# Altium schematic sheet 11 - Wireless - CAN.SchDoc
size B; CompanyName: Microchip Technology Inc.; Organization: Microchip Technology; Address1: 2355 West Chandler Blvd.; Address2: Chandler, AZ  85224; Address4: USA; SheetNumber: 12; SheetTotal: 15; SheetTitle: Wireless - CAN; Time: Time
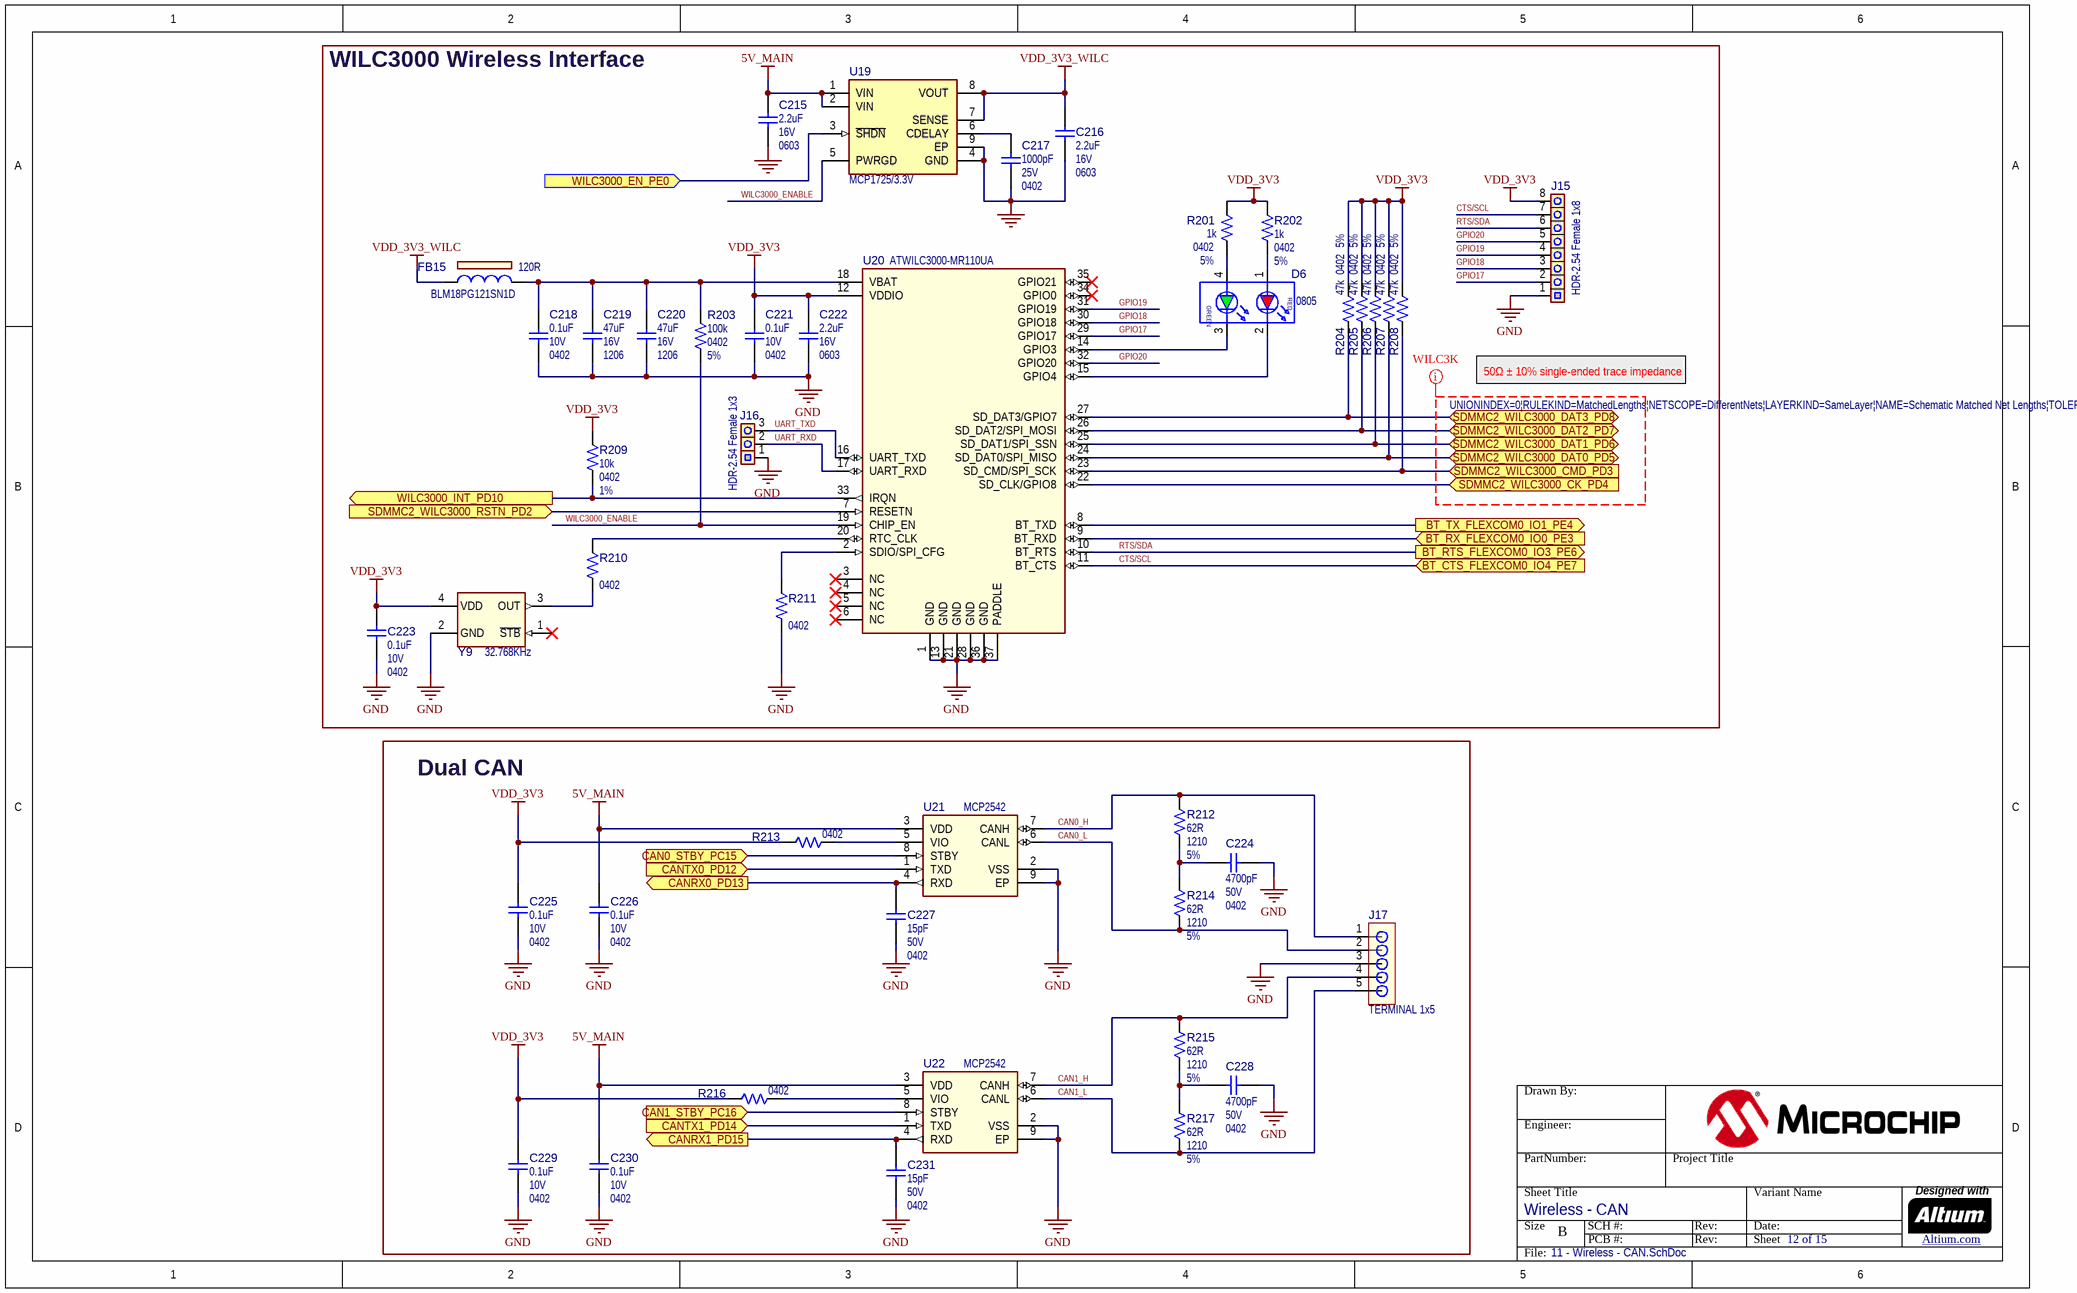
[diagram p0: 11 - Wireless - CAN.SchDoc]

## Parts
?  (no value)  (graphical)
C215  value 2.2uF  Voltage: 16V  Package: 0603  [CAP_C_0603]  (hidden comment: Capacitor NP)
C216  value 2.2uF  Voltage: 16V  Package: 0603  [CAP_C_0603]  (hidden comment: Capacitor NP)
C217  value 1000pF  Voltage: 25V  Package: 0402  [CAP_C_0402]  (hidden comment: Capacitor NP)
C218  value 0.1uF  Voltage: 10V  Package: 0402  [CAP_C_0402]  (hidden comment: Capacitor NP)
C219  value 47uF  Voltage: 16V  Package: 1206  [CAP_C_1206]  (hidden comment: Capacitor NP)
C220  value 47uF  Voltage: 16V  Package: 1206  [CAP_C_1206]  (hidden comment: Capacitor NP)
C221  value 0.1uF  Voltage: 10V  Package: 0402  [CAP_C_0402]  (hidden comment: Capacitor NP)
C222  value 2.2uF  Voltage: 16V  Package: 0603  [CAP_C_0603]  (hidden comment: Capacitor NP)
C223  value 0.1uF  Voltage: 10V  Package: 0402  [CAP_C_0402]  (hidden comment: Capacitor NP)
C224  value 4700pF  Voltage: 50V  Package: 0402  [CAP_C_0402]  (hidden comment: Capacitor NP)
C225  value 0.1uF  Voltage: 10V  Package: 0402  [CAP_C_0402]  (hidden comment: Capacitor NP)
C226  value 0.1uF  Voltage: 10V  Package: 0402  [CAP_C_0402]  (hidden comment: Capacitor NP)
C227  value 15pF  Voltage: 50V  Package: 0402  [CAP_C_0402]  (hidden comment: Capacitor NP)
C228  value 4700pF  Voltage: 50V  Package: 0402  [CAP_C_0402]  (hidden comment: Capacitor NP)
C229  value 0.1uF  Voltage: 10V  Package: 0402  [CAP_C_0402]  (hidden comment: Capacitor NP)
C230  value 0.1uF  Voltage: 10V  Package: 0402  [CAP_C_0402]  (hidden comment: Capacitor NP)
C231  value 15pF  Voltage: 50V  Package: 0402  [CAP_C_0402]  (hidden comment: Capacitor NP)
D6  Package: 0805  [LED_DUAL_SMD_2x1.25mm]  (hidden comment: LED DUAL 4 pin)
FB15  value 120R  Manufacturer Part Number 1: BLM18PG121SN1D  [IND_C_0603]  (hidden comment: Ferrite Bead)
J15  value HDR-2.54 Female 1x8  [HDR_F_2.54_1X8]  (hidden comment: Header 1x8)
J16  value HDR-2.54 Female 1x3  [HDR_F_2.54_1x3]  (hidden comment: Header 1x3)
J17  value TERMINAL 1x5  [CON_TERMINAL_3.81_1x5_TH_RA_PHO_1727049]  (hidden comment: Header 1x5)
R201  value 1k  Package: 0402  Tolerance: 5%  [RES_C_0402]  (hidden comment: Resistor)
R202  value 1k  Package: 0402  Tolerance: 5%  [RES_C_0402]  (hidden comment: Resistor)
R203  value 100k  Package: 0402  Tolerance: 5%  [RES_C_0402]  (hidden comment: Resistor)
R204  value 47k  Package: 0402  Tolerance: 5%  [RES_C_0402]  (hidden comment: Resistor)
R205  value 47k  Package: 0402  Tolerance: 5%  [RES_C_0402]  (hidden comment: Resistor)
R206  value 47k  Package: 0402  Tolerance: 5%  [RES_C_0402]  (hidden comment: Resistor)
R207  value 47k  Package: 0402  Tolerance: 5%  [RES_C_0402]  (hidden comment: Resistor)
R208  value 47k  Package: 0402  Tolerance: 5%  [RES_C_0402]  (hidden comment: Resistor)
R209  value 10k  Package: 0402  Tolerance: 1%  [RES_C_0402]  (hidden comment: Resistor)
R210  Package: 0402  [RES_C_0402]  (hidden comment: Resistor)
R211  Package: 0402  [RES_C_0402]  (hidden comment: Resistor)
R212  value 62R  Package: 1210  Tolerance: 5%  [RES_C_1210]  (hidden comment: Resistor)
R213  Package: 0402  [RES_C_0402]  (hidden comment: Resistor)
R214  value 62R  Package: 1210  Tolerance: 5%  [RES_C_1210]  (hidden comment: Resistor)
R215  value 62R  Package: 1210  Tolerance: 5%  [RES_C_1210]  (hidden comment: Resistor)
R216  Package: 0402  [RES_C_0402]  (hidden comment: Resistor)
R217  value 62R  Package: 1210  Tolerance: 5%  [RES_C_1210]  (hidden comment: Resistor)
U19  value MCP1725/3.3V  [DFN-8_2x3]  (hidden comment: MCP172X FIX DFN-8)
U20  value ATWILC3000-MR110UA  [MODULE ATWILC3000-MR110CA]  (hidden comment: MODULE ATWILC3000-MR110CA)
U21  value MCP2542  [DFN-8_3x3_EP2.4X1.55]  (hidden comment: MCP2542 DFN-8)
U22  value MCP2542  [DFN-8_3x3_EP2.4X1.55]  (hidden comment: MCP2542 DFN-8)
Y9  value 32.768KHz  [DFN-4_2x1.6]  (hidden comment: DSC60xx DFN-4_LGA-4)

## Blocks framed on the sheet
WILC3000 Wireless Interface: C215-C223 D6 FB15 J15 J16 R201-R211 U19 U20 Y9
Dual CAN: C224-C231 J17 R212-R217 U21 U22

## Ports
BT_CTS_FLEXCOM0_IO4_PE7 (in), BT_RTS_FLEXCOM0_IO3_PE6 (out), BT_RX_FLEXCOM0_IO0_PE3 (in), BT_TX_FLEXCOM0_IO1_PE4 (out), CAN0_STBY_PC15 (in), CAN1_STBY_PC16 (in), CANRX0_PD13 (out), CANRX1_PD15 (out), CANTX0_PD12 (in), CANTX1_PD14 (in), SDMMC2_WILC3000_CK_PD4 (in), SDMMC2_WILC3000_CMD_PD3 (in), SDMMC2_WILC3000_DAT0_PD5 (bidir), SDMMC2_WILC3000_DAT1_PD6 (bidir), SDMMC2_WILC3000_DAT2_PD7 (bidir), SDMMC2_WILC3000_DAT3_PD8 (bidir), SDMMC2_WILC3000_RSTN_PD2 (in), WILC3000_EN_PE0 (in), WILC3000_INT_PD10 (out)

## Nets
5V_MAIN: C215.1 C226.1 C230.1 U19.1(VIN) U19.2(VIN) U21.3(VDD) U22.3(VDD)
GND: C215.2 C216.1 C217.1 C218.2 C219.2 C220.2 C221.2 C222.1 C223.2 C224.1 C225.2 C226.2 C227.1 C228.1 C229.2 C230.2 C231.1 J15.1 J16.1 J17.3 R211.2 U19.4(GND) U19.9(EP) U20.1(GND) U20.13(GND) U20.21(GND) U20.28(GND) U20.36(GND) U20.37(PADDLE) U21.2(VSS) U21.9(EP) U22.2(VSS) U22.9(EP) Y9.2(GND)
VDD_3V3: C221.1 C222.2 C223.1 C225.1 C229.1 J15.8 R201.2 R202.2 R204.2 R205.2 R206.2 R207.2 R208.2 R209.2 R213.1 R216.1 U20.12(VDDIO) Y9.4(VDD)
VDD_3V3_WILC: C216.2 FB15.1 U19.7(SENSE) U19.8(VOUT)
BT_RX_FLEXCOM0_IO0_PE3: U20.9(BT_RXD) ; port BT_RX_FLEXCOM0_IO0_PE3
BT_TX_FLEXCOM0_IO1_PE4: U20.8(BT_TXD) ; port BT_TX_FLEXCOM0_IO1_PE4
CAN0_H: J17.1 R212.2 U21.7(CANH)
CAN0_L: J17.2 R214.1 U21.6(CANL)
CAN0_STBY_PC15: U21.8(STBY) ; port CAN0_STBY_PC15
CAN1_H: J17.4 R215.2 U22.7(CANH)
CAN1_L: J17.5 R217.1 U22.6(CANL)
CAN1_STBY_PC16: U22.8(STBY) ; port CAN1_STBY_PC16
CANRX0_PD13: C227.2 U21.4(RXD) ; port CANRX0_PD13
CANRX1_PD15: C231.2 U22.4(RXD) ; port CANRX1_PD15
CANTX0_PD12: U21.1(TXD) ; port CANTX0_PD12
CANTX1_PD14: U22.1(TXD) ; port CANTX1_PD14
CTS/SCL: J15.7 U20.11(BT_CTS) ; port BT_CTS_FLEXCOM0_IO4_PE7
GPIO17: J15.2 U20.29(GPIO17)
GPIO18: J15.3 U20.30(GPIO18)
GPIO19: J15.4 U20.31(GPIO19)
GPIO20: J15.5 U20.32(GPIO20)
RTS/SDA: J15.6 U20.10(BT_RTS) ; port BT_RTS_FLEXCOM0_IO3_PE6
SDMMC2_WILC3000_CK_PD4: U20.22(SD_CLK/GPIO8) ; port SDMMC2_WILC3000_CK_PD4
SDMMC2_WILC3000_CMD_PD3: R208.1 U20.23(SD_CMD/SPI_SCK) ; port SDMMC2_WILC3000_CMD_PD3
SDMMC2_WILC3000_DAT0_PD5: R207.1 U20.24(SD_DAT0/SPI_MISO) ; port SDMMC2_WILC3000_DAT0_PD5
SDMMC2_WILC3000_DAT1_PD6: R206.1 U20.25(SD_DAT1/SPI_SSN) ; port SDMMC2_WILC3000_DAT1_PD6
SDMMC2_WILC3000_DAT2_PD7: R205.1 U20.26(SD_DAT2/SPI_MOSI) ; port SDMMC2_WILC3000_DAT2_PD7
SDMMC2_WILC3000_DAT3_PD8: R204.1 U20.27(SD_DAT3/GPIO7) ; port SDMMC2_WILC3000_DAT3_PD8
SDMMC2_WILC3000_RSTN_PD2: U20.7(RESETN) ; port SDMMC2_WILC3000_RSTN_PD2
UART_RXD: J16.2 U20.17(UART_RXD)
UART_TXD: J16.3 U20.16(UART_TXD)
WILC3000_EN_PE0: U19.3(~{SHDN}) ; port WILC3000_EN_PE0
WILC3000_ENABLE: R203.1 U19.5(PWRGD) U20.19(CHIP_EN)
WILC3000_INT_PD10: R209.1 U20.33(IRQN) ; port WILC3000_INT_PD10
NetC217_2: C217.2 U19.6(CDELAY)
NetC218_1: C218.1 C219.1 C220.1 FB15.2 R203.2 U20.18(VBAT)
NetC224_2: C224.2 R212.1 R214.2
NetC228_2: C228.2 R215.1 R217.2
NetD6_1: D6.1(A1) R202.1
NetD6_2: D6.2(K1) U20.15(GPIO4)
NetD6_3: D6.3(K2) U20.14(GPIO3)
NetD6_4: D6.4(A2) R201.1
NetR210_1: R210.1 U20.20(RTC_CLK)
NetR210_2: R210.2 Y9.3(OUT)
NetR211_1: R211.1 U20.2(SDIO/SPI_CFG)
NetR213_2: R213.2 U21.5(VIO)
NetR216_2: R216.2 U22.5(VIO)

Not connected (* = marked no-connect by the designer): U20 3(NC)* 4(NC)* 5(NC)* 6(NC)* 34(GPIO0)* 35(GPIO21)*; Y9 1(~{STB})*

## Layout directives
net class WILC3K; rule Matched Net Lengths [Tolerance = 0.25mm]: (no net found under the mark)

## Notes on the sheet
- 50Ω ± 10% single-ended trace impedance
- Drawn By:
- Engineer:
- PartNumber:
- Project Title
- Sheet Title
- Size
- B
- SCH #:
- PCB #:
- Rev:
- Variant Name
- Date:
- Sheet
- Designed with
- Altium.com <http://go.altium.com/MicrochipLandingPage_Evaluation.html>
- File:
- (in symbol DIODE1110) RED; GREEN

## Library data of the parts
? = Title Block B
C215 C216 C222 = CAP0597: Capacitor; Manufacturer 1: TDK; Manufacturer Part Number 1: C1608X5R1C225K; Description_: CAP CER 2.2uF 16V 10% X5R SMD 0603; Dev Tools Status: Production; Tolerance: 10%; Temperature Coeffcient: X5R; Type: Ceramic; Populated: Yes; MCHP-ID: CAP0597; Revision: 2; Symbol: Capacitor NP; Status: MCL Design; ComponentLink1URL: https://chn-vm-apps.microchip.com/mchprepo/parts/Datasheets/general_B11.pdf; ComponentLink1Description: SVN Datasheet; ComponentLink2URL: C:\ALTIUM_WORK\00001_MCHP-CDB\Datasheets\general_B11.pdf; ComponentLink2Description: Local Datasheet; ComponentLink3URL: C:\ALTIUM_WORK\00001_MCHP-CDB\Library\LibraryRefs\Capacitor NP.SchLib; ComponentLink3Description: Open Symbol; ComponentLink4URL: C:\ALTIUM_WORK\00001_MCHP-CDB\Library\Footprints\CAP_C_0603.PcbLib; ComponentLink4Description: Open Footprint; ComponentLink5Description: Open Footprint 2; ComponentLink6Description: Open Footprint 3; ComponentLink7Description: Open Footprint 4; Operating Temperature: -55C to +85C; Category: Capacitor; Supplier 1: Digi-Key; Supplier Part Number 1: 445-5157-1-ND; Quantity Override: 1
C217 = CAP2439: Manufacturer 1: Samsung Electro-Mechanics; Manufacturer Part Number 1: CL05B102KA5NNWC; Description_: Ceramic capacitor, SMD 0402, X7R, 25V, +/-10%, 1000pF; Dev Tools Status: Design; Tolerance: 10%; Temperature Coeffcient: X7R; Type: Ceramic; Populated: YES; Owner: Dragos Danaila; MCHP-ID: CAP2439; Revision: 1; Symbol: Capacitor NP; Status: MCL Design; ComponentLink1URL: https://chn-vm-apps.microchip.com/mchprepo/parts/Datasheets/MLCC.pdf; ComponentLink1Description: SVN Datasheet; ComponentLink2URL: C:\ALTIUM_WORK\00001_MCHP-CDB\Datasheets\MLCC.pdf; ComponentLink2Description: Local Datasheet; ComponentLink3URL: C:\ALTIUM_WORK\00001_MCHP-CDB\Library\LibraryRefs\Capacitor NP.SchLib; ComponentLink3Description: Open Symbol; ComponentLink4URL: C:\ALTIUM_WORK\00001_MCHP-CDB\Library\Footprints\CAP_C_0402.PcbLib; ComponentLink4Description: Open Footprint; ComponentLink5Description: Open Footprint 2; ComponentLink6Description: Open Footprint 3; ComponentLink7Description: Open Footprint 4; Operating Temperature: -55C to +125C; Category: Capacitor; Supplier 1: Digikey; Supplier Part Number 1: 1276-1490-1-ND; Quantity Override: 1
C218 C221 C223 C225 C226 C229 C230 = CAP1238: Capacitor; Manufacturer 1: KEMET; Manufacturer Part Number 1: C0402C104K8RACTU; Description_: CAP CER 0.1uF 10V 10% X7R SMD 0402; Dev Tools Status: Production; Tolerance: 10%; Temperature Coeffcient: X7R; Type: Ceramic; Owner: Tad Ahlvers; Populated: YES; MCHP-ID: CAP1238; Revision: 1; Symbol: Capacitor NP; Status: MCL Design; ComponentLink1URL: https://chn-vm-apps.microchip.com/mchprepo/parts/Datasheets/KEM_C1002_X7R_SMD.pdf; ComponentLink1Description: SVN Datasheet; ComponentLink2URL: C:\ALTIUM_WORK\00001_MCHP-CDB\Datasheets\KEM_C1002_X7R_SMD.pdf; ComponentLink2Description: Local Datasheet; ComponentLink3URL: C:\ALTIUM_WORK\00001_MCHP-CDB\Library\LibraryRefs\Capacitor NP.SchLib; ComponentLink3Description: Open Symbol; ComponentLink4URL: C:\ALTIUM_WORK\00001_MCHP-CDB\Library\Footprints\CAP_C_0402.PcbLib; ComponentLink4Description: Open Footprint; ComponentLink5Description: Open Footprint 2; ComponentLink6Description: Open Footprint 3; ComponentLink7Description: Open Footprint 4; Operating Temperature: -55C to +125C; Category: Capacitor; Supplier 1: Digi-Key; Supplier Part Number 1: 399-3520-2-ND; Quantity Override: 1; Manufacturer 2: Samsung; Manufacturer Part Number 2: CL05B104KP5NNNC; Manufacturer 3: Murata Electronics; Manufacturer Part Number 3: GRM155R71A104KA01D; Supplier 2: Digi-Key; Supplier Part Number 2: 1276-1002-2-ND; Supplier 3: Mouser; Supplier Part Number 3: 81-GRM155R71A104KA1D
C219 = CAP1331: Capacitor; Manufacturer 1: TDK Corporation; Manufacturer Part Number 1: C3216X5R1C476M160AB; Description_: CAP CER 47uF 16V 20% X5R SMD 1206; Dev Tools Status: Production; Tolerance: 20%; Temperature Coeffcient: X5R; Type: Ceramic; Owner: Bogdan Popescu; Populated: YES; MCHP-ID: CAP1331; Revision: 1; Symbol: Capacitor NP; Status: MCL Design; ComponentLink1URL: https://chn-vm-apps.microchip.com/mchprepo/parts/Datasheets/TDKMLCCCapRange.pdf; ComponentLink1Description: SVN Datasheet; ComponentLink2URL: C:\ALTIUM_WORK\00001_MCHP-CDB\Datasheets\TDKMLCCCapRange.pdf; ComponentLink2Description: Local Datasheet; ComponentLink3URL: C:\ALTIUM_WORK\00001_MCHP-CDB\Library\LibraryRefs\Capacitor NP.SchLib; ComponentLink3Description: Open Symbol; ComponentLink4URL: C:\ALTIUM_WORK\00001_MCHP-CDB\Library\Footprints\CAP_C_1206.PcbLib; ComponentLink4Description: Open Footprint; ComponentLink5Description: Open Footprint 2; ComponentLink6Description: Open Footprint 3; ComponentLink7Description: Open Footprint 4; Operating Temperature: -55C to +85C; Category: Capacitor; Supplier 1: Digi-Key; Supplier Part Number 1: 445-6003-1-ND; Quantity Override: 1
C220 = CAP1331: Capacitor; Manufacturer 1: TDK Corporation; Manufacturer Part Number 1: C3216X5R1C476M160AB; Description_: CAP CER 47uF 16V 20% X5R SMD 1206; Dev Tools Status: Production; Tolerance: 20%; Temperature Coeffcient: X5R; Type: Ceramic; Owner: Bogdan Popescu; Populated: DNP; MCHP-ID: CAP1331; Revision: 1; Symbol: Capacitor NP; Status: MCL Design; ComponentLink1URL: https://chn-vm-apps.microchip.com/mchprepo/parts/Datasheets/TDKMLCCCapRange.pdf; ComponentLink1Description: SVN Datasheet; ComponentLink2URL: C:\ALTIUM_WORK\00001_MCHP-CDB\Datasheets\TDKMLCCCapRange.pdf; ComponentLink2Description: Local Datasheet; ComponentLink3URL: C:\ALTIUM_WORK\00001_MCHP-CDB\Library\LibraryRefs\Capacitor NP.SchLib; ComponentLink3Description: Open Symbol; ComponentLink4URL: C:\ALTIUM_WORK\00001_MCHP-CDB\Library\Footprints\CAP_C_1206.PcbLib; ComponentLink4Description: Open Footprint; ComponentLink5Description: Open Footprint 2; ComponentLink6Description: Open Footprint 3; ComponentLink7Description: Open Footprint 4; Operating Temperature: -55C to +85C; Category: Capacitor; Supplier 1: Digi-Key; Supplier Part Number 1: 445-6003-1-ND; Quantity Override: 1
C224 C228 = CAP1391: Capacitor; Manufacturer 1: Murata Electronics North America; Manufacturer Part Number 1: GRM155R71H472KA01D; Description_: CAP CER 4700pF 50V 10% X7R SMD 0402 (Don't Use, Duplicate, use CAP1391); Dev Tools Status: Design; Tolerance: 10%; Temperature Coeffcient: X7R; Type: Ceramic; Owner: Gabor Bihari; Populated: YES; MCHP-ID: CAP1391; Revision: A; Symbol: Capacitor NP; Status: MCL Design; ComponentLink1URL: https://chn-vm-apps.microchip.com/mchprepo/parts/Datasheets/http://www.murata.com/~/media/webrenewal/support/library/catalog/products/capacitor/mlcc/c02e.ashx; ComponentLink1Description: SVN Datasheet; ComponentLink2URL: C:\ALTIUM_WORK\00001_MCHP-CDB\Datasheets\http://www.murata.com/~/media/webrenewal/support/library/catalog/products/capacitor/mlcc/c02e.ashx; ComponentLink2Description: Local Datasheet; ComponentLink3URL: C:\ALTIUM_WORK\00001_MCHP-CDB\Library\LibraryRefs\Capacitor NP.SchLib; ComponentLink3Description: Open Symbol; ComponentLink4URL: C:\ALTIUM_WORK\00001_MCHP-CDB\Library\Footprints\CAP_C_0402.PcbLib; ComponentLink4Description: Open Footprint; ComponentLink5Description: Open Footprint 2; ComponentLink6Description: Open Footprint 3; ComponentLink7Description: Open Footprint 4; Operating Temperature: -55C to 125C; Category: Capacitor; Supplier 1: Digi-Key; Supplier Part Number 1: 490-1308-1-ND; Quantity Override: 1
C227 C231 = CAP2440: Manufacturer 1: Samsung Electro-Mechanics; Manufacturer Part Number 1: CL05C150JB5NNNC; Description_: Ceramic capacitor, SMD 0402, C0G, 50V, +/-10%, 15pF; Dev Tools Status: Design; Tolerance: 5%; Temperature Coeffcient: C0G; Type: Ceramic; Populated: YES; Owner: Dragos Danaila; MCHP-ID: CAP2440; Revision: 1; Symbol: Capacitor NP; Status: MCL Design; ComponentLink1URL: https://chn-vm-apps.microchip.com/mchprepo/parts/Datasheets/CL_Series_MLCC_ds.pdf; ComponentLink1Description: SVN Datasheet; ComponentLink2URL: C:\ALTIUM_WORK\00001_MCHP-CDB\Datasheets\CL_Series_MLCC_ds.pdf; ComponentLink2Description: Local Datasheet; ComponentLink3URL: C:\ALTIUM_WORK\00001_MCHP-CDB\Library\LibraryRefs\Capacitor NP.SchLib; ComponentLink3Description: Open Symbol; ComponentLink4URL: C:\ALTIUM_WORK\00001_MCHP-CDB\Library\Footprints\CAP_C_0402.PcbLib; ComponentLink4Description: Open Footprint; ComponentLink5Description: Open Footprint 2; ComponentLink6Description: Open Footprint 3; ComponentLink7Description: Open Footprint 4; Operating Temperature: -55C to +125C; Category: Capacitor; Supplier 1: Digikey; Supplier Part Number 1: 1276-1179-1-ND; Quantity Override: 1
D6 = DIODE1110: LED; Manufacturer 1: Kingbright Corp; Manufacturer Part Number 1: APHBM2012SURKCGKC; Value: RED, GREEN; Description_: DIO LED BI RED, GREEN 1.95V, 2.1V 30mA 0805; Dev Tools Status: Production; Type: LED Bicolor; Forward Current: 30mA; Power: 75mW; Reverse Current: 10uA; Owner: Bogdan P (M91398); Populated: Yes; MCHP-ID: DIODE1110; Revision: 0; Symbol: LED DUAL 4 PIN; Status: MCL Design; ComponentLink1URL: https://chn-vm-apps.microchip.com/mchprepo/parts/Datasheets/APHBM2012SURKCGKC.pdf; ComponentLink1Description: SVN Datasheet; ComponentLink2URL: C:\ALTIUM_WORK\00001_MCHP-CDB\Datasheets\APHBM2012SURKCGKC.pdf; ComponentLink2Description: Local Datasheet; ComponentLink3URL: C:\ALTIUM_WORK\00001_MCHP-CDB\Library\LibraryRefs\LED DUAL 4 PIN.SchLib; ComponentLink3Description: Open Symbol; ComponentLink4URL: C:\ALTIUM_WORK\00001_MCHP-CDB\Library\Footprints\LED_DUAL_SMD_2x1.25mm.PcbLib; ComponentLink4Description: Open Footprint; ComponentLink5Description: Open Footprint 2; ComponentLink6Description: Open Footprint 3; ComponentLink7Description: Open Footprint 4; Operating Temperature: -40C to +85C; Category: Diode; Supplier 1: Digi-Key; Supplier Part Number 1: 754-1093-1-ND; Quantity Override: 1
FB15 = IND1009: Manufacturer 1: Murata; Description_: FERRITE 120R@100MHz 2A SMD 0603; Dev Tools Status: Production; Owner: Petnarong Chaijaroong; DCR: 0.05R; Saturation Current: 12A; Populated: Yes; MCHP-ID: IND1009; Revision: 0; Symbol: Ferrite Bead; Status: MCL Design; ComponentLink1URL: https://chn-vm-apps.microchip.com/mchprepo/parts/Datasheets/L0110S0100BLM18P.pdf; ComponentLink1Description: SVN Datasheet; ComponentLink2URL: C:\ALTIUM_WORK\00001_MCHP-CDB\Datasheets\L0110S0100BLM18P.pdf; ComponentLink2Description: Local Datasheet; ComponentLink3URL: C:\ALTIUM_WORK\00001_MCHP-CDB\Library\LibraryRefs\Ferrite Bead.SchLib; ComponentLink3Description: Open Symbol; ComponentLink4URL: C:\ALTIUM_WORK\00001_MCHP-CDB\Library\Footprints\IND_C_0603.PcbLib; ComponentLink4Description: Open Footprint; ComponentLink5Description: Open Footprint 2; ComponentLink6Description: Open Footprint 3; ComponentLink7Description: Open Footprint 4; Operating Temperature: -55C to +125C; Package: 0603; Type: Ferrite Bead; Category: Inductor; Supplier 1: Digi-Key; Supplier Part Number 1: 490-1037-1-ND; Quantity Override: 1
J15 = CON1363: CON HDR-2.54 Female 1x8 Gold TH; Manufacturer 1: Sullins Connector Solutions; Manufacturer Part Number 1: PPPC081LFBN-RC; Dev Tools Status: Production; Owner: Jamus Griego; Populated: DNP; MCHP-ID: CON1363; Revision: 1; Symbol: Header 1x8; Description_: CON HDR-2.54 Female 1x8 Gold TH; Status: MCL Design; ComponentLink1URL: https://chn-vm-apps.microchip.com/mchprepo/parts/Datasheets/78_P(N)PxCxxxLFBN-RC,_10492-G.pdf; ComponentLink1Description: SVN Datasheet; ComponentLink2URL: C:\ALTIUM_WORK\00001_MCHP-CDB\Datasheets\78_P(N)PxCxxxLFBN-RC,_10492-G.pdf; ComponentLink2Description: Local Datasheet; ComponentLink3URL: C:\ALTIUM_WORK\00001_MCHP-CDB\Library\LibraryRefs\Header 1x8.SchLib; ComponentLink3Description: Open Symbol; ComponentLink4URL: C:\ALTIUM_WORK\00001_MCHP-CDB\Library\Footprints\HDR_F_2.54_1X8.PcbLib; ComponentLink4Description: Open Footprint; ComponentLink5Description: Open Footprint 2; ComponentLink6Description: Open Footprint 3; ComponentLink7Description: Open Footprint 4; Type: Header 2.54mm; Category: Connector; Manufacturer 2: Nextron; Manufacturer Part Number 2: R-212-0810-0071-000; Supplier 1: Digi-Key; Supplier Part Number 1: S7041-ND; Supplier 2: Nextron; Supplier Part Number 2: R-212-0810-0071-000; Quantity Override: 1
J16 = CON1425: Manufacturer 1: TE Connectivity AMP Connectors; Manufacturer Part Number 1: 5-534237-1; Description_: CON HDR-2.54 Female 1x3 Gold 8.64MH TH VERT; Dev Tools Status: Production; Owner: Md Khan; Populated: DNP; MCHP-ID: CON1425; Revision: 1; Symbol: Header 1x3; Status: MCL Design; ComponentLink1Description: SVN Datasheet; ComponentLink2Description: Local Datasheet; ComponentLink3URL: C:\ALTIUM_WORK\00001_MCHP-CDB\Library\LibraryRefs\Header 1x3.SchLib; ComponentLink3Description: Open Symbol; ComponentLink4URL: C:\ALTIUM_WORK\00001_MCHP-CDB\Library\Footprints\HDR_F_2.54_1x3.PcbLib; ComponentLink4Description: Open Footprint; ComponentLink5Description: Open Footprint 2; ComponentLink6Description: Open Footprint 3; ComponentLink7Description: Open Footprint 4; Type: Header 2.54mm; Category: Connector; Supplier 1: Digi-Key; Supplier Part Number 1: A32904-ND; Quantity Override: 1
J17 = CON1693: Manufacturer 1: Phoenix Contact; Manufacturer Part Number 1: 1727049; Description_: CON TERMINAL 3.81mm 1x5 Female 16-30AWG 13.5A TH R/A; Dev Tools Status: Design; Owner: Ciprian Abramov; Voltage: 300; Current: 13.5A; Populated: YES; MCHP-ID: CON1693; Revision: A; Symbol: CON TERM BLK 1x5 TH Mount; Status: MCL Design; ComponentLink1URL: https://chn-vm-apps.microchip.com/mchprepo/parts/Datasheets/1727049.pdf; ComponentLink1Description: SVN Datasheet; ComponentLink2URL: C:\ALTIUM_WORK\00001_MCHP-CDB\Datasheets\1727049.pdf; ComponentLink2Description: Local Datasheet; ComponentLink3URL: C:\ALTIUM_WORK\00001_MCHP-CDB\Library\LibraryRefs\CON TERM BLK 1x5 TH Mount.SchLib; ComponentLink3Description: Open Symbol; ComponentLink4URL: C:\ALTIUM_WORK\00001_MCHP-CDB\Library\Footprints\CON_TERMINAL_3.81_1x5_TH_RA_PHO_1727049.PcbLib; ComponentLink4Description: Open Footprint; ComponentLink5Description: Open Footprint 2; ComponentLink6Description: Open Footprint 3; ComponentLink7Description: Open Footprint 4; Type: Terminal Block; Category: Connector; Supplier 1: Digi-Key; Supplier Part Number 1: 277-1950-ND; Quantity Override: 1
R201 R202 = RSMT0316: Manufacturer 1: Panasonic; Manufacturer Part Number 1: ERJ-2GEJ102X; Description_: RES TKF 1k 5% 1/16W SMD 0402; Dev Tools Status: Production; Voltage: 50V; Temperature Coeffcient: 200ppm/C; Power: 1/16W; Owner: Tad Ahlvers; Populated: YES; MCHP-ID: RSMT0316; Revision: 1; Symbol: Resistor; Status: MCL Design; ComponentLink1URL: https://chn-vm-apps.microchip.com/mchprepo/parts/Datasheets/AOA0000CE1.pdf; ComponentLink1Description: SVN Datasheet; ComponentLink2URL: C:\ALTIUM_WORK\00001_MCHP-CDB\Datasheets\AOA0000CE1.pdf; ComponentLink2Description: Local Datasheet; ComponentLink3URL: C:\ALTIUM_WORK\00001_MCHP-CDB\Library\LibraryRefs\Resistor.SchLib; ComponentLink3Description: Open Symbol; ComponentLink4URL: C:\ALTIUM_WORK\00001_MCHP-CDB\Library\Footprints\RES_C_0402.PcbLib; ComponentLink4Description: Open Footprint; ComponentLink5Description: Open Footprint 2; ComponentLink6Description: Open Footprint 3; ComponentLink7Description: Open Footprint 4; Operating Temperature: -55C to +155C; Category: Resistor; Type: RES SMD; Composition: TKF; Supplier 1: Digi-Key; Supplier Part Number 1: P1.0KJCT-ND; Quantity Override: 1
R203 = RSMT0737: Manufacturer 1: Panasonic; Manufacturer Part Number 1: ERJ-2GEJ104X; Description_: RES TKF 100k 5% 1/10W SMD 0402; Dev Tools Status: Production; Temperature Coeffcient: 200ppm/C; Power: 1/10W; Populated: Yes; Voltage: 50V; MCHP-ID: RSMT0737; Revision: 1; Symbol: Resistor; Status: MCL Design; ComponentLink1URL: https://chn-vm-apps.microchip.com/mchprepo/parts/Datasheets/AOA0000CE1.pdf; ComponentLink1Description: SVN Datasheet; ComponentLink2URL: C:\ALTIUM_WORK\00001_MCHP-CDB\Datasheets\AOA0000CE1.pdf; ComponentLink2Description: Local Datasheet; ComponentLink3URL: C:\ALTIUM_WORK\00001_MCHP-CDB\Library\LibraryRefs\Resistor.SchLib; ComponentLink3Description: Open Symbol; ComponentLink4URL: C:\ALTIUM_WORK\00001_MCHP-CDB\Library\Footprints\RES_C_0402.PcbLib; ComponentLink4Description: Open Footprint; ComponentLink5Description: Open Footprint 2; ComponentLink6Description: Open Footprint 3; ComponentLink7Description: Open Footprint 4; Category: Resistor; Type: RES SMD; Composition: TKF; Supplier 1: Digi-Key; Supplier Part Number 1: P100KJCT-ND; Quantity Override: 1; Operating Temperature: -55C to +155C; Manufacturer 2: Stackpole Electronics Inc; Manufacturer Part Number 2: RMCF0402JT100K; Supplier 2: Digi-Key; Supplier Part Number 2: RMCF0402JT100KCT-ND
R204-R208 = RES1038: Manufacturer 1: Panasonic; Manufacturer Part Number 1: ERJ-2GEJ473X; Description_: RES TKF 47k 5% 1/10W SMD 0402; Dev Tools Status: Production; Temperature Coeffcient: 200ppm/C; Power: 1/10W; Owner: Tad Ahlvers; Populated: YES; Voltage: 50V; MCHP-ID: RES1038; Revision: 1; Symbol: Resistor; Status: MCL Design; ComponentLink1URL: https://chn-vm-apps.microchip.com/mchprepo/parts/Datasheets/AOA0000CE1.pdf; ComponentLink1Description: SVN Datasheet; ComponentLink2URL: C:\ALTIUM_WORK\00001_MCHP-CDB\Datasheets\AOA0000CE1.pdf; ComponentLink2Description: Local Datasheet; ComponentLink3URL: C:\ALTIUM_WORK\00001_MCHP-CDB\Library\LibraryRefs\Resistor.SchLib; ComponentLink3Description: Open Symbol; ComponentLink4URL: C:\ALTIUM_WORK\00001_MCHP-CDB\Library\Footprints\RES_C_0402.PcbLib; ComponentLink4Description: Open Footprint; ComponentLink5Description: Open Footprint 2; ComponentLink6Description: Open Footprint 3; ComponentLink7Description: Open Footprint 4; Category: Resistor; Type: RES SMD; Composition: TKF; Supplier 1: Digi-Key; Supplier Part Number 1: P47KJTR-ND; Quantity Override: 1; Operating Temperature: -55C to +155C
R209 = RSMT1019: Manufacturer 1: Panasonic; Manufacturer Part Number 1: ERJ-2RKF1002X; Description_: RES TKF 10k 1% 1/10W SMD 0402; Dev Tools Status: Production; Voltage: 50V; Temperature Coeffcient: 100ppm/C; Power: 1/10W; Populated: Yes; Owner: Brent Lanphear; MCHP-ID: RSMT1019; Revision: 2; Symbol: Resistor; Status: MCL Design; ComponentLink1URL: https://chn-vm-apps.microchip.com/mchprepo/parts/Datasheets/AOA0000CE2.pdf; ComponentLink1Description: SVN Datasheet; ComponentLink2URL: C:\ALTIUM_WORK\00001_MCHP-CDB\Datasheets\AOA0000CE2.pdf; ComponentLink2Description: Local Datasheet; ComponentLink3URL: C:\ALTIUM_WORK\00001_MCHP-CDB\Library\LibraryRefs\Resistor.SchLib; ComponentLink3Description: Open Symbol; ComponentLink4URL: C:\ALTIUM_WORK\00001_MCHP-CDB\Library\Footprints\RES_C_0402.PcbLib; ComponentLink4Description: Open Footprint; ComponentLink5Description: Open Footprint 2; ComponentLink6Description: Open Footprint 3; ComponentLink7Description: Open Footprint 4; Operating Temperature: -55C to +155C; Category: Resistor; Type: RES SMD; Composition: TKF; Supplier 1: Digi-Key; Supplier Part Number 1: P10.0KLCT-ND; Quantity Override: 1
R210 R211 R213 R216 = RES2693: Manufacturer 1: Bourns Inc.; Manufacturer Part Number 1: CR0402-J/-000GLF; Description_: RES TKF 0R 1/16W SMD 0402; Dev Tools Status: Design; Power: 1/16W; Owner: Dragos Danaila; Populated: YES; Voltage: 50V; Temperature Coeffcient: 100ppm/C; Current: 1A; MCHP-ID: RES2693; Revision: 1; Symbol: Resistor; Status: MCL Design; ComponentLink1URL: https://chn-vm-apps.microchip.com/mchprepo/parts/Datasheets/crxxxxx.pdf; ComponentLink1Description: SVN Datasheet; ComponentLink2URL: C:\ALTIUM_WORK\00001_MCHP-CDB\Datasheets\crxxxxx.pdf; ComponentLink2Description: Local Datasheet; ComponentLink3URL: C:\ALTIUM_WORK\00001_MCHP-CDB\Library\LibraryRefs\Resistor.SchLib; ComponentLink3Description: Open Symbol; ComponentLink4URL: C:\ALTIUM_WORK\00001_MCHP-CDB\Library\Footprints\RES_C_0402.PcbLib; ComponentLink4Description: Open Footprint; ComponentLink5Description: Open Footprint 2; ComponentLink6Description: Open Footprint 3; ComponentLink7Description: Open Footprint 4; Operating Temperature: -55C to +155C; Category: Resistor; Type: RES SMD; Composition: TKF; Supplier 1: Digikey; Supplier Part Number 1: CR0402-J/-000GLFTR-ND; Quantity Override: 1
R212 R214 R215 R217 = RES2695: Manufacturer 1: Stackpole Electronics Inc; Manufacturer Part Number 1: RPC1210JT62R0CT-ND; Description_: RES TKF 62R 5% 1/2W SMD 1210; Dev Tools Status: Design; Voltage: 200V; Temperature Coeffcient: 100ppm/C; Power: 1/2W; Owner: Dragos Danaila; Populated: YES; MCHP-ID: RES2695; Revision: 1; Symbol: Resistor; Status: MCL Design; ComponentLink1URL: https://chn-vm-apps.microchip.com/mchprepo/parts/Datasheets/sei-rpc.pdf; ComponentLink1Description: SVN Datasheet; ComponentLink2URL: C:\ALTIUM_WORK\00001_MCHP-CDB\Datasheets\sei-rpc.pdf; ComponentLink2Description: Local Datasheet; ComponentLink3URL: C:\ALTIUM_WORK\00001_MCHP-CDB\Library\LibraryRefs\Resistor.SchLib; ComponentLink3Description: Open Symbol; ComponentLink4URL: C:\ALTIUM_WORK\00001_MCHP-CDB\Library\Footprints\RES_C_1210.PcbLib; ComponentLink4Description: Open Footprint; ComponentLink5Description: Open Footprint 2; ComponentLink6Description: Open Footprint 3; ComponentLink7Description: Open Footprint 4; Operating Temperature: -55C to +155C; Category: Resistor; Type: RES SMD; Composition: TKF; Supplier 1: Digikey; Supplier Part Number 1: RPC1210JT62R0CT-ND; Quantity Override: 1
U19 = MIC2599: LDO; Manufacturer 1: Microchip; Manufacturer Part Number 1: MCP1725T-3302E/MC; Description_: MCHP ANALOG LDO 3.3V MCP1725T-3302E/MC DFN-8; MAPS Description: 500MA, LOW VOLTAGE LDO; Dev Tools Status: Production; MPC: GEAH1YB3XA33; LeadContent: Pb-FREE; PackingMedia: T/R; Stage: REL; LeadCount: 8; PackageWidth: 2x3x0.9mm; ForceMinOrderQtyMult: True; MinOrderQty: 1; TempRange: -40C to +125C; tblDeviceFamilyID: 1781; Populated: Yes; MCHP-ID: MIC2599; Symbol: MCP172X FIX DFN-8; Type: LDO; Status: MCL Design; Revision: 0; Category: MCHP-Analog; ComponentLink1URL: http://www.microchip.com/wwwproducts/MCP1725; ComponentLink1Description: SVN Datasheet; ComponentLink2Description: Local Datasheet; ComponentLink3URL: C:\ALTIUM_WORK\00001_MCHP-CDB\Library\LibraryRefs\MCP172X FIX DFN-8.SchLib; ComponentLink3Description: Open Symbol; ComponentLink4URL: C:\ALTIUM_WORK\00001_MCHP-CDB\Library\Footprints\DFN-8_2x3.PcbLib; ComponentLink4Description: Open Footprint; ComponentLink5Description: Open Footprint 2; ComponentLink6Description: Open Footprint 3; ComponentLink7Description: Open Footprint 4; Manufacturer 2: Microchip; Manufacturer Part Number 2: MCP1725-3302E/MC; Supplier 1: Microchip; Supplier Part Number 1: MCP1725T-3302E/MC; Supplier 2: Microchip; Supplier Part Number 2: MCP1725-3302E/MC; IntroductionDate: 2006-12-22; PackageType: DFN; Quantity Override: 1
U20 = MIC8126: Manufacturer 1: Microchip Technology; Description_: MCHP RF WI-FI 802.11b/g/n ATWILC3000-MR110UA; MAPS Description: SmartConnect WILC3000-MR110UA Module; Dev Tools Status: Design; Owner: Ilie Galan; tblDeviceFamilyID: 11256; FrequencyRange: 2.412-2.472 MHz; MaxSpeedMHz: 0; Populated: DNP; PowerRX: 84mA (802.11n MCS7); PowerTX: 253mA (802.11n MCS7); Sleep: 1.25uA; MCHP-ID: MIC8126; Symbol: MODULE ATWILC3000-MR110CA; Type: Wi-Fi; Status: MCL Design; Revision: A; Category: MCHP-Wireless; ComponentLink1URL: http://www.microchip.com/wwwproducts/ATWILC3000; ComponentLink1Description: SVN Datasheet; ComponentLink2URL: C:\ALTIUM_WORK\00001_MCHP-CDB\Datasheets\70005327A.pdf; ComponentLink2Description: Local Datasheet; ComponentLink3URL: C:\ALTIUM_WORK\00001_MCHP-CDB\Library\LibraryRefs\MODULE ATWILC3000-MR110CA.SchLib; ComponentLink3Description: Open Symbol; ComponentLink4URL: C:\ALTIUM_WORK\00001_MCHP-CDB\Library\Footprints\MODULE ATWILC3000-MR110CA.PcbLib; ComponentLink4Description: Open Footprint; ComponentLink5Description: Open Footprint 2; ComponentLink6Description: Open Footprint 3; ComponentLink7Description: Open Footprint 4; Manufacturer Part Number 1: ATWILC3000-MR110UA; Supplier 1: Digi-Key; Supplier Part Number 1: ATWILC3000-MR110UA-ND; RfDataRate: 0; RfPower: 0; VDDmax: 0; VDDmin: 0; Quantity Override: 1; Supplier 2: Microchip; Supplier Part Number 2: Microchip Technology ATWILC3000-MR110UA
U21 U22 = MIC7856: Manufacturer 1: Microchip Technology; Manufacturer Part Number 1: MCP2542FDT-E/MF; Description_: MCHP INTERFACE CAN MCP2542FDT-E/MF DFN-8; MAPS Description: CAN Transceiver; Dev Tools Status: Design; Owner: Ilie Galan; MPC: V7BC6YA7XA00; LeadContent: Pb-FREE; PackingMedia: T/R; Stage: REL; LeadCount: 8; PackageWidth: 3x3x0.9mm; ForceMinOrderQtyMult: True; MinOrderQty: 3300; TempRange: -40C to +125C; tblDeviceFamilyID: 5993; DeviceType: Transceiver; OperatingVoltageMin: 4.5; OperatingVoltageMax: 5.5; StandbyCurrentMax: 15; OperatingCurrentMax: 10; PropDelayMax: 120; ShortCircuit: -58 to +58; TransientVoltage: -150 to +100; ESD: 13; ThermalShutdown: Yes; CMR: +/-12; Masks: 0; Comments: Flexible Data Rate Capable; MCHP-ID: MIC7856; Symbol: MCP2542 DFN-8; Type: CAN; Status: MCL Design; Revision: A; Category: MCHP-Interface; ComponentLink1URL: http://www.microchip.com/wwwproducts/Devices.aspx?product=MCP2542FD; ComponentLink1Description: SVN Datasheet; ComponentLink2URL: C:\ALTIUM_WORK\00001_MCHP-CDB\Datasheets\MCP2542.pdf; ComponentLink2Description: Local Datasheet; ComponentLink3URL: C:\ALTIUM_WORK\00001_MCHP-CDB\Library\LibraryRefs\MCP2542 DFN-8.SchLib; ComponentLink3Description: Open Symbol; ComponentLink4URL: C:\ALTIUM_WORK\00001_MCHP-CDB\Library\Footprints\DFN-8_3x3_EP2.4X1.55.PcbLib; ComponentLink4Description: Open Footprint; ComponentLink5Description: Open Footprint 2; ComponentLink6Description: Open Footprint 3; ComponentLink7Description: Open Footprint 4; Supplier 1: Digi-Key; Supplier Part Number 1: MCP2542FDT-E/MFCT-ND; IntroductionDate: 2016-03-07; PackageType: DFN; BitrateMax: 8; TxDDominantDetector: Yes; Filters: 0; Populated: YES; Quantity Override: 1
Y9 = MIC9395: Manufacturer 1: Microchip Technology; Manufacturer Part Number 1: DSC6003MI3B-032K768; Description_: MCHP CLOCK OSCILLATOR SINGLE 32.768KHz DSC6003MI3B-032K768 SMD DFN-4; Dev Tools Status: Design; Owner: Ciprian Abramov; Populated: YES; MCHP-ID: MIC9395; Revision: 1; Symbol: DSC60xx DFN-4_LGA-4; Status: MCL Design; ComponentLink1Description: SVN Datasheet; ComponentLink2Description: Local Datasheet; ComponentLink3URL: C:\ALTIUM_WORK\00001_MCHP-CDB\Library\LibraryRefs\DSC60xx DFN-4_LGA-4.SchLib; ComponentLink3Description: Open Symbol; ComponentLink4URL: C:\ALTIUM_WORK\00001_MCHP-CDB\Library\Footprints\DFN-4_2x1.6.PcbLib; ComponentLink4Description: Open Footprint; ComponentLink5Description: Open Footprint 2; ComponentLink6Description: Open Footprint 3; ComponentLink7Description: Open Footprint 4; Category: MCHP-Clock/Timing; Type: Oscillator; Supplier 1: Microchip Technology; Supplier Part Number 1: DSC6003MI3B-032K768; Quantity Override: 1; ComponentLink1URL: https://www.microchip.com/sitesearch/search/Product%20and%20Development%20Tools/DSC6003MI3B-032K768; Operating Temperature: -40C to +85C